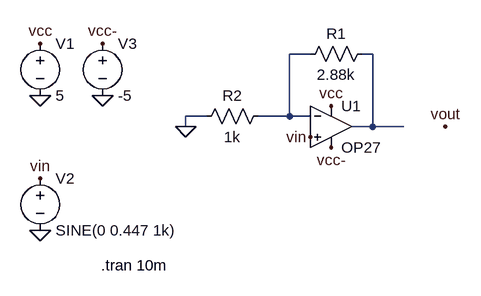
[diagram p0: schematic Draft1.asc]
Draft1.asc, the LTspice schematic file:
Version 4
SHEET 1 880 680
WIRE 96 32 64 32
WIRE 192 32 176 32
WIRE -64 128 -96 128
WIRE 64 128 64 32
WIRE 64 128 16 128
WIRE 96 128 64 128
WIRE -96 144 -96 128
WIRE 192 144 192 32
WIRE 192 144 160 144
WIRE 240 144 192 144
FLAG -320 16 vcc
FLAG -320 96 0
FLAG 128 112 vcc
FLAG -96 144 0
FLAG -320 304 0
FLAG -320 224 vin
FLAG 304 144 vout
FLAG -224 96 0
FLAG -224 16 vcc-
FLAG 128 176 vcc-
FLAG 96 160 vin
SYMBOL OpAmps\\OP27 128 80 R0
SYMATTR InstName U1
SYMBOL res 192 16 R90
WINDOW 0 0 56 VBottom 2
WINDOW 3 32 56 VTop 2
SYMATTR InstName R1
SYMATTR Value 2.88k
SYMBOL voltage -320 0 R0
WINDOW 123 0 0 Left 0
WINDOW 39 0 0 Left 0
SYMATTR InstName V1
SYMATTR Value 5
SYMBOL voltage -320 208 R0
WINDOW 123 0 0 Left 0
WINDOW 39 24 124 Left 2
SYMATTR InstName V2
SYMATTR Value SINE(0 0.447 1k)
SYMBOL res 32 112 R90
WINDOW 0 0 56 VBottom 2
WINDOW 3 32 56 VTop 2
SYMATTR InstName R2
SYMATTR Value 1k
SYMBOL voltage -224 0 R0
WINDOW 123 0 0 Left 0
WINDOW 39 0 0 Left 0
SYMATTR InstName V3
SYMATTR Value -5
TEXT -226 358 Left 2 !.tran 10m

The netlist it stands for:
* Draft1.asc
XU1 vin N001 vcc vcc- N002 OP27  ; pins In+ In- V+ V- OUT
R1 N002 N001 2.88k
V1 vcc 0 5
V2 vin 0 SINE(0 0.447 1k)
R2 N001 0 1k
V3 vcc- 0 -5
.tran 10m
.lib ADI.lib
.backanno
.end